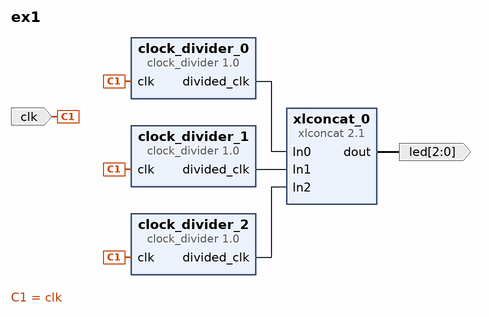
[diagram p0: block diagram of the top level]
# Vivado block design ex1, Vivado 2015.4
create_bd_design ex1

create_bd_port -dir I clk
create_bd_port -dir O -from 2 -to 0 led

create_bd_cell -type ip -vlnv ua.pt:user:clock_divider:1.0 clock_divider_0
create_bd_cell -type ip -vlnv ua.pt:user:clock_divider:1.0 clock_divider_1
set_property -dict {CONFIG.how_fast 25} [get_bd_cells clock_divider_1]
create_bd_cell -type ip -vlnv ua.pt:user:clock_divider:1.0 clock_divider_2
set_property -dict {CONFIG.how_fast 24} [get_bd_cells clock_divider_2]
create_bd_cell -type ip -vlnv xilinx.com:ip:xlconcat:2.1 xlconcat_0
set_property -dict {CONFIG.NUM_PORTS 3 CONFIG.IN0_WIDTH 1 CONFIG.IN1_WIDTH 1 CONFIG.IN2_WIDTH 1} [get_bd_cells xlconcat_0]

# ---- connections ----

connect_bd_net [get_bd_ports clk] [get_bd_pins clock_divider_0/clk] [get_bd_pins clock_divider_1/clk] [get_bd_pins clock_divider_2/clk]
connect_bd_net [get_bd_pins xlconcat_0/dout] [get_bd_ports led]
connect_bd_net [get_bd_pins clock_divider_0/divided_clk] [get_bd_pins xlconcat_0/In0]
connect_bd_net [get_bd_pins clock_divider_1/divided_clk] [get_bd_pins xlconcat_0/In1]
connect_bd_net [get_bd_pins clock_divider_2/divided_clk] [get_bd_pins xlconcat_0/In2]

validate_bd_design
save_bd_design
